# Altium project Main PCB.PrjPCB
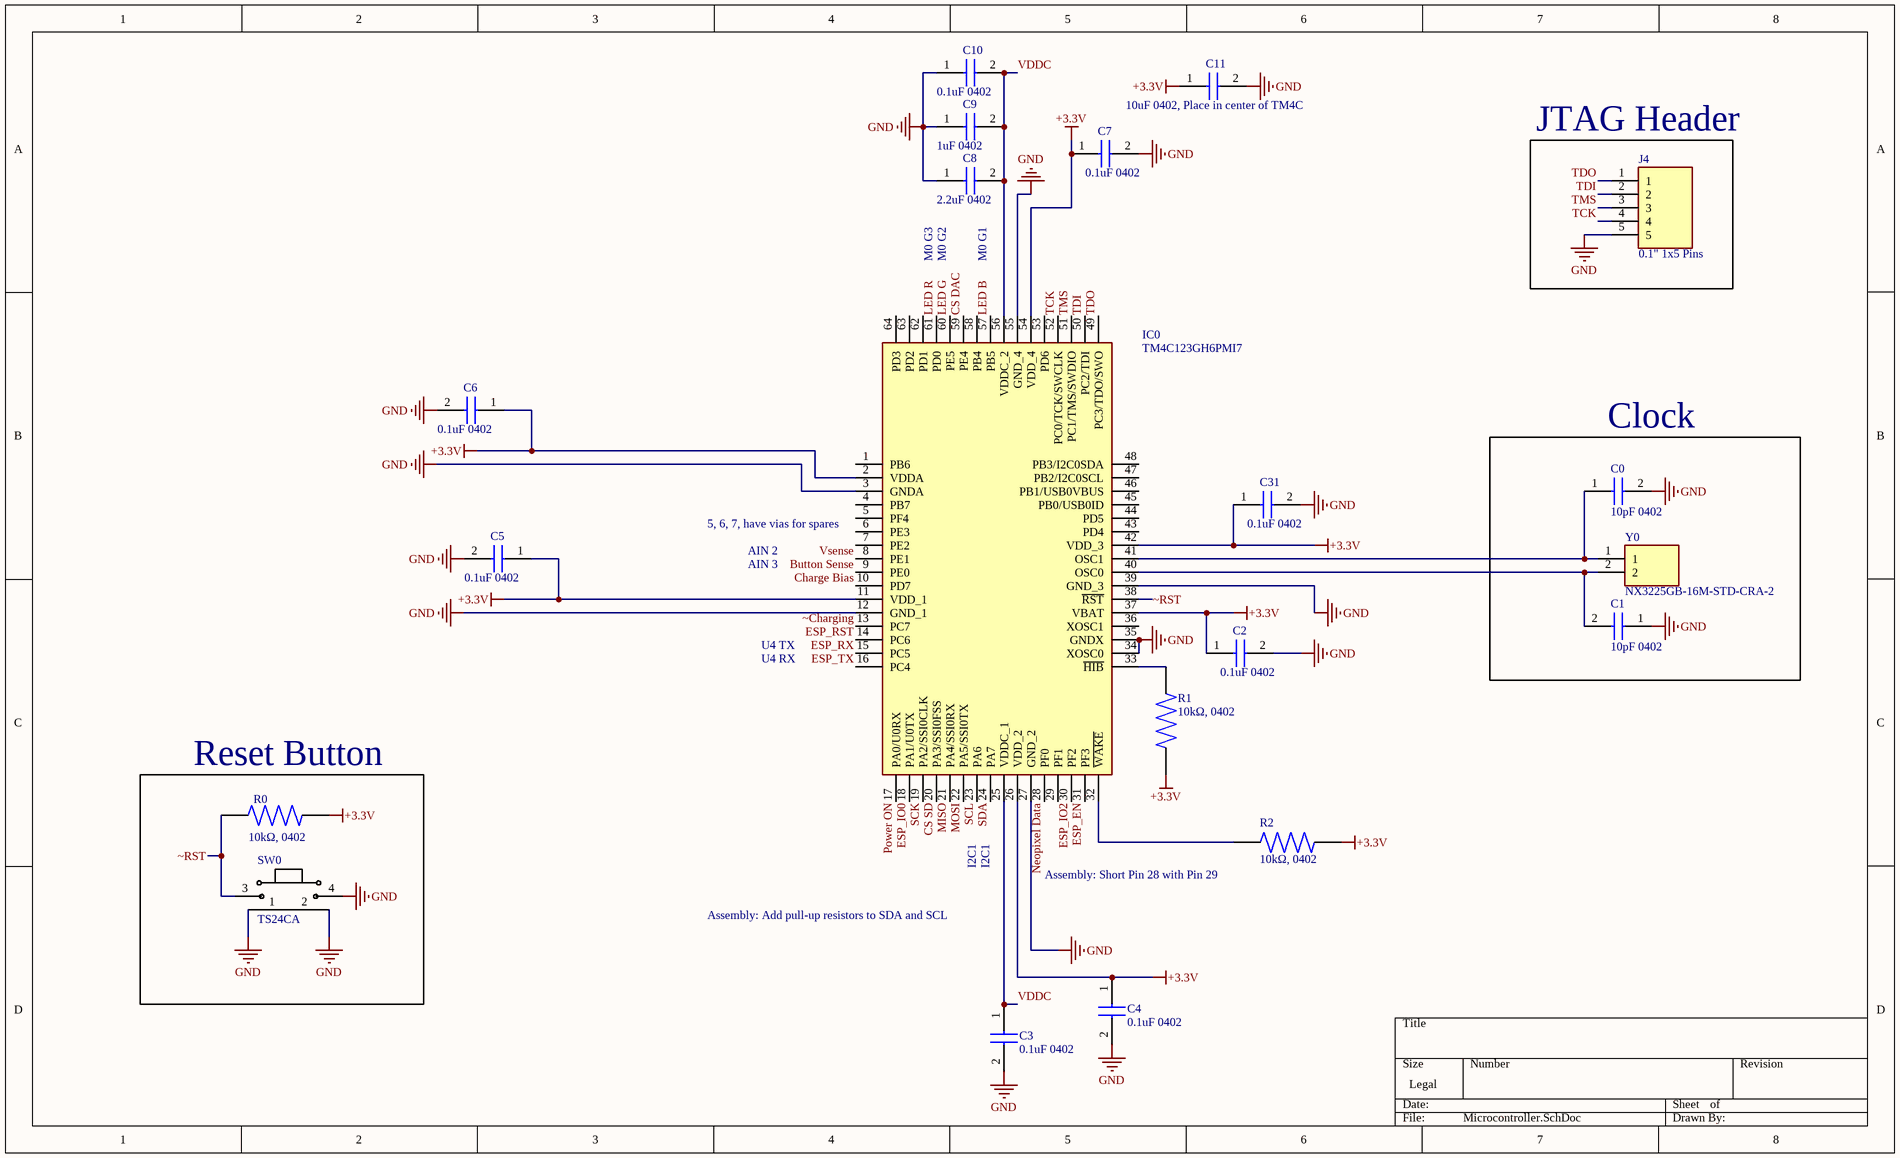
[diagram p0: Microcontroller.SchDoc]
3 sheets, 79 parts. Net scope: global (net labels, ports and power ports of the same name join across sheets).
Board files: jlcpcb.PcbDoc, main pcb.PcbDoc
Sheets:
  Microcontroller.SchDoc
  Peripherals.SchDoc
  Power.SchDoc

## Sheet Microcontroller.SchDoc
size Legal

### Parts
C0  10pF 0402  [CAPC1005X56N]
C1  10pF 0402  [CAPC1005X56N]
C2  0.1uF 0402  [CAPC1005X56N]
C3  0.1uF 0402  [CAPC1005X56N]
C4  0.1uF 0402  [CAPC1005X56N]
C5  0.1uF 0402  [CAPC1005X56N]
C6  0.1uF 0402  [CAPC1005X56N]
C7  0.1uF 0402  [CAPC1005X56N]
C8  2.2uF 0402  [CAPC1005X56N]
C9  1uF 0402  [CAPC1005X56N]
C10  0.1uF 0402  [CAPC1005X56N]
C11  10uF 0402, Place in center of TM4C  [CAPC1005X56N]
C31  0.1uF 0402  [CAPC1005X56N]
IC0  TM4C123GH6PMI7  [QFP50P1200X1200X160-64N]
J4  0.1" 1x5 Pins  [HDRV5W64P0X254_1X5_1270X254X610P]
R0  10kΩ, 0402  [0402]
R1  10kΩ, 0402  [0402]
R2  10kΩ, 0402  [0402]
SW0  TS24CA  [TS24CA]
Y0  NX3225GB-16M-STD-CRA-2  [NX3225GD-STD-CRA-3]

### Blocks framed on the sheet
JTAG Header: J4
Clock: C0 C1 Y0
Reset Button: R0 SW0

### Nets
+3.3V: C2.1 C4.1 C5.1 C6.1 C7.1 C11.1 C31.1 IC0.2(VDDA) IC0.11(VDD_1) IC0.26(VDD_2) IC0.37(VBAT) IC0.42(VDD_3) IC0.54(VDD_4) R0.2 R1.2 R2.2
GND: C0.2 C1.1 C2.2 C3.2 C4.2 C5.2 C6.2 C7.2 C8.1 C9.1 C10.1 C11.2 C31.2 IC0.3(GNDA) IC0.12(GND_1) IC0.27(GND_2) IC0.34(XOSC0) IC0.35(GNDX) IC0.39(GND_3) IC0.55(GND_4) J4.5 SW0.1 SW0.2 SW0.4
Button Sense: IC0.9(PE0)  [project net Button N/O B]
Charge Bias: IC0.10(PD7)
CS DAC: IC0.59(PE4)
CS SD: IC0.20(PA3/SSI0FSS)
ESP_EN: IC0.31(PF3)
ESP_IO0: IC0.18(PA1/U0TX)
ESP_IO2: IC0.30(PF2)
ESP_RST: IC0.14(PC6)
ESP_RX: IC0.15(PC5)
ESP_TX: IC0.16(PC4)
LED B: IC0.57(PB5)
LED G: IC0.60(PE5)
LED R: IC0.61(PD0)
MISO: IC0.21(PA4/SSI0RX)
MOSI: IC0.22(PA5/SSI0TX)
Neopixel Data: IC0.28(PF0)
Power ON: IC0.17(PA0/U0RX)
SCK: IC0.19(PA2/SSI0CLK)
SCL: IC0.23(PA6)
SDA: IC0.24(PA7)
TCK: IC0.52(PC0/TCK/SWCLK) J4.4
TDI: IC0.50(PC2/TDI) J4.2
TDO: IC0.49(PC3/TDO/SWO) J4.1
TMS: IC0.51(PC1/TMS/SWDIO) J4.3
VDDC: C3.1 C8.2 C9.2 C10.2 IC0.25(VDDC_1) IC0.56(VDDC_2)
Vsense: IC0.8(PE1)
~Charging: IC0.13(PC7)
~RST: IC0.38(~{RST}) R0.1 SW0.3
NetC0_1: C0.1 IC0.41(OSC1) Y0.1
NetC1_2: C1.2 IC0.40(OSC0) Y0.2
NetIC0_32: IC0.32(~{WAKE}) R2.1
NetIC0_33: IC0.33(~{HIB}) R1.1

Not connected (* = marked no-connect by the designer): IC0 1(PB6) 4(PB7) 5(PF4) 6(PE3) 7(PE2) 29(PF1) 36(XOSC1) 43(PD4) 44(PD5) 45(PB0/USB0ID) 46(PB1/USB0VBUS) 47(PB2/I2C0SCL) 48(PB3/I2C0SDA) 53(PD6) 58(PB4) 62(PD1) 63(PD2) 64(PD3)

### Notes on the sheet
- M0 G3
- M0 G2
- (near C8) M0 G1
- (near IC0) 5, 6, 7, have vias for spares
- AIN 2
- AIN 3
- U4 TX
- U4 RX
- I2C1
- (near R2) Assembly: Short Pin 28 with Pin 29
- Assembly: Add pull-up resistors to SDA and SCL

### Library data of the parts
C0-C11 C31 = 04025A100BAT2A: Capacitor; Manufacturer_Name: AVX; Datasheet Link: http://www.mouser.com/catalog/supplier/library/pdf/AVXSurfaceMountCeramic.pdf; Height: 0.56mm; Manufacturer_Part_Number: 04025A100BAT2A; Arrow Part Number: 04025A100BAT2A; Arrow Price/Stock: https://www.arrow.com/en/products/04025a100bat2a/avx; Mouser Part Number: 581-04025A100B; Mouser Price/Stock: https://www.mouser.com/Search/Refine.aspx?Keyword=581-04025A100B
IC0 = TM4C123GH6PMI7: Integrated Circuit; Manufacturer_Name: Texas Instruments; Datasheet Link: http://www.ti.com/lit/gpn/tm4c123gh6pm; Height: 1.6mm; Manufacturer_Part_Number: TM4C123GH6PMI7; Arrow Part Number: TM4C123GH6PMI7; Arrow Price/Stock: https://www.arrow.com/en/products/tm4c123gh6pmi7/texas-instruments; Mouser Part Number: 595-TM4C123GH6PMI7; Mouser Price/Stock: https://www.mouser.co.uk/ProductDetail/Texas-Instruments/TM4C123GH6PMI7?qs=m%2F7bTylgptcEEuXHNU46tA%3D%3D
J4 = M20-9990546: Connector; Manufacturer_Name: Harwin; Datasheet Link: http://docs-emea.rs-online.com/webdocs/0da6/0900766b80da602d.pdf; Height: 6.1mm; Manufacturer_Part_Number: M20-9990546; Mouser Part Number: 855-M20-9990546; Mouser Price/Stock: https://www.mouser.co.uk/ProductDetail/Harwin/M20-9990546?qs=ulE8k0yEMYY8EKyDN9ic6A%3D%3D
R0-R2 = Resistor, 0402
Y0 = NX3225GB-16M-STD-CRA-2: Crystal or Oscillator; Manufacturer_Name: NDK; Datasheet Link: http://www.ndk.com/images/products/catalog/c_NX3225GB-STD-CRA-2_e.pdf; Manufacturer_Part_Number: NX3225GB-16M-STD-CRA-2; Mouser Part Number: 344-NX3225GB16MSTRA2; Mouser Price/Stock: https://www.mouser.co.uk/ProductDetail/NDK/NX3225GB-16M-STD-CRA-2?qs=w%2Fv1CP2dgqqz6Fo69dRGLg%3D%3D

## Sheet Peripherals.SchDoc
size Legal
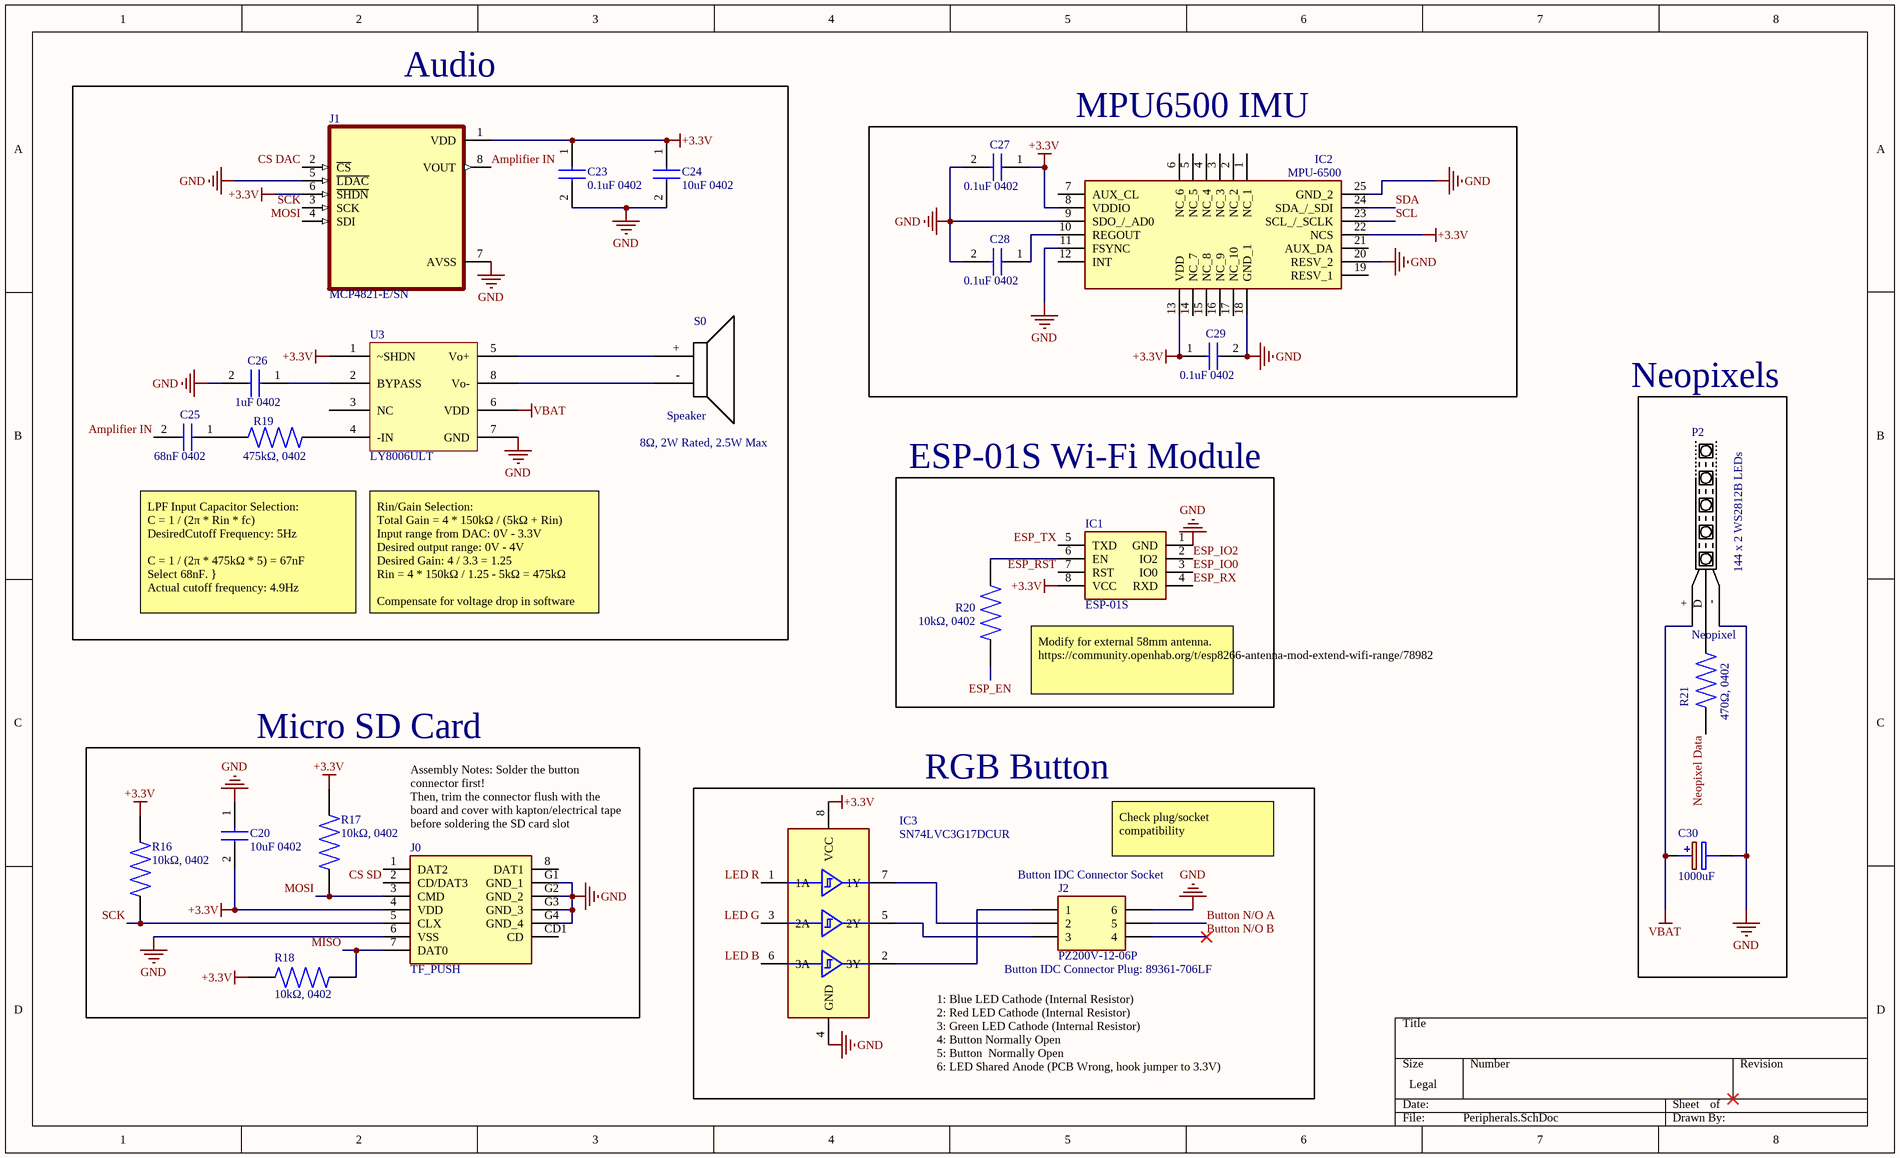
[diagram p1: Peripherals.SchDoc]

### Parts
C20  10uF 0402  [CAPC1005X56N]
C23  0.1uF 0402  [CAPC1005X56N]
C24  10uF 0402  [CAPC1005X56N]
C25  68nF 0402  [CAPC1005X56N]
C26  1uF 0402  [CAPC1005X56N]
C27  0.1uF 0402  [CAPC1005X56N]
C28  0.1uF 0402  [CAPC1005X56N]
C29  0.1uF 0402  [CAPC1005X56N]
C30  1000uF  [8x10.2mm Radial Capacitor]
IC1  ESP-01S  [ESP-01]
IC2  MPU-6500  [QFN-24]
IC3  SN74LVC3G17DCUR  [SOP50P310X90-8N]
J0  TF_PUSH  [TFPUSH]
J1  MCP4821-E/SN  [SOIC127P600X175-8N]
J2  PZ200V-12-06P  [2mm 2x3 Header TH]
P2  Neopixel  [Neopixel Pads]
R16  10kΩ, 0402  [0402]
R17  10kΩ, 0402  [0402]
R18  10kΩ, 0402  [0402]
R19  475kΩ, 0402  [0402]
R20  10kΩ, 0402  [0402]
R21  470Ω, 0402  [0402]
S0  Speaker  [SPEAKER PADS]
U3  LY8006ULT  [MSOP-8]

### Blocks framed on the sheet
Audio: C23-C26 J1 R19 S0 U3
MPU6500 IMU: C27-C29 IC2
Neopixels: C30 P2 R21
ESP-01S Wi-Fi Module: IC1 R20
Micro SD Card: C20 J0 R16-R18
RGB Button: IC3 J2

### Nets
+3.3V: C20.2 C23.1 C24.1 C27.1 C29.1 IC1.8(VCC) IC2.8(VDDIO) IC2.13(VDD) IC2.22(NCS) IC3.8(VCC) J0.4(VDD) J1.1(VDD) J1.6(~{SHDN}) R16.2 R17.2 R18.2 U3.1(~SHDN)
GND: C20.1 C23.2 C24.2 C26.2 C27.2 C28.2 C29.2 C30.2(-) IC1.1(GND) IC2.9(SDO_/_AD0) IC2.11(FSYNC) IC2.18(GND_1) IC2.20(RESV_2) IC2.25(GND_2) IC3.4(GND) J0.6(VSS) J0.G1(GND_1) J0.G2(GND_2) J0.G3(GND_3) J0.G4(GND_4) J1.5(~{LDAC}) J1.7(AVSS) J2.6 P2.- U3.7(GND)
VBAT: C30.1(+) P2.+ U3.6(VDD)
Amplifier IN: C25.2 J1.8(VOUT)
Button N/O A: J2.5
Button N/O B: J2.4
CS DAC: J1.2(~{CS})
CS SD: J0.2(CD/DAT3)
ESP_EN: R20.1
ESP_IO0: IC1.3(IO0)
ESP_IO2: IC1.2(IO2)
ESP_RST: IC1.7(RST)
ESP_RX: IC1.4(RXD)
ESP_TX: IC1.5(TXD)
LED B: IC3.6(3A)
LED G: IC3.3(2A)
LED R: IC3.1(1A)
MISO: J0.7(DAT0) R18.1
MOSI: J0.3(CMD) J1.4(SDI) R17.1
Neopixel Data: R21.2
SCK: J0.5(CLX) J1.3(SCK) R16.1
SCL: IC2.23(SCL_/_SCLK)
SDA: IC2.24(SDA_/_SDI)
NetC25_1: C25.1 R19.1
NetC26_1: C26.1 U3.2(BYPASS)
NetC28_1: C28.1 IC2.10(REGOUT)
NetIC1_6: IC1.6(EN) R20.2
NetIC3_2: IC3.2(3Y) J2.1
NetIC3_5: IC3.5(2Y) J2.3
NetIC3_7: IC3.7(1Y) J2.2
NetP2_D: P2.D R21.1
NetR19_2: R19.2 U3.4(-IN)
NetS0_+: S0.+ U3.5(Vo+)
NetS0_-: S0.- U3.8(Vo-)

Not connected (* = marked no-connect by the designer): IC2 1(NC_1) 2(NC_2) 3(NC_3) 4(NC_4) 5(NC_5) 6(NC_6) 7(AUX_CL) 12(INT) 14(NC_7) 15(NC_8) 16(NC_9) 17(NC_10) 19(RESV_1) 21(AUX_DA); J0 1(DAT2) 8(DAT1) CD1(CD); U3 3(NC)

### Notes on the sheet
- 8Ω, 2W Rated, 2.5W Max
- (near P2) 144 x 2 WS2812B LEDs
- LPF Input Capacitor Selection:
  C = 1 / (2π * Rin * fc)
  DesiredCutoff Frequency: 5Hz
  C = 1 / (2π * 475kΩ * 5) = 67nF
  Select 68nF. }
  Actual cutoff frequency: 4.9Hz
- Rin/Gain Selection:
  Total Gain = 4 * 150kΩ / (5kΩ + Rin)
  Input range from DAC: 0V - 3.3V
  Desired output range: 0V - 4V
  Desired Gain: 4 / 3.3 = 1.25
  Rin = 4 * 150kΩ / 1.25 - 5kΩ = 475kΩ
  Compensate for voltage drop in software
- Modify for external 58mm antenna.
  https://community.openhab.org/t/esp8266-antenna-mod-extend-wifi-range/78982
- (near J0) Assembly Notes: Solder the button connector first!
  Then, trim the connector flush with the board and cover with kapton/electrical tape before soldering the SD card slot
- (near J2) Button IDC Connector Socket
- Check plug/socket compatibility
- (near J2) Button IDC Connector Plug: 89361-706LF
- 1: Blue LED Cathode (Internal Resistor)
  2: Red LED Cathode (Internal Resistor)
  3: Green LED Cathode (Internal Resistor)
  4: Button Normally Open
  5: Button  Normally Open
  6: LED Shared Anode (PCB Wrong, hook jumper to 3.3V)

### Library data of the parts
C20 C23-C29 = 04025A100BAT2A: Capacitor; Manufacturer_Name: AVX; Datasheet Link: http://www.mouser.com/catalog/supplier/library/pdf/AVXSurfaceMountCeramic.pdf; Height: 0.56mm; Manufacturer_Part_Number: 04025A100BAT2A; Arrow Part Number: 04025A100BAT2A; Arrow Price/Stock: https://www.arrow.com/en/products/04025a100bat2a/avx; Mouser Part Number: 581-04025A100B; Mouser Price/Stock: https://www.mouser.com/Search/Refine.aspx?Keyword=581-04025A100B
C30 = 8x10.2mm Radial Capacitor: Capacitor Polarised; Manufacturer_Name: Cinch Connectivity Solutions; Manufacturer_Part_Number: 107CKS035M; Datasheet Link: http://www.farnell.com/datasheets/1912641.pdf; Height: 12.5mm
IC1 = ESP-01S: Integrated Circuit; Manufacturer_Name: Ai-Thinker; Datasheet Link: http://wiki.ai-thinker.com/_media/esp8266/esp8266_series_modules_user_manual_v1.1.pdf; Height: 2mm; Manufacturer_Part_Number: ESP-01
IC2 = MPU-6500: Integrated Circuit; Manufacturer_Name: TDK; Datasheet Link: https://www.invensense.com/wp-content/uploads/2015/02/MPU-6500-Datasheet2.pdf; Height: 0.95mm; Manufacturer_Part_Number: MPU-6500; Arrow Part Number: MPU-6500; Arrow Price/Stock: https://www.arrow.com/en/products/mpu-6500/invensense; Mouser Part Number: 410-MPU-6500
IC3 = SN74LVC3G17DCUR: Integrated Circuit; Manufacturer_Name: Texas Instruments; Datasheet Link: http://www.ti.com/lit/ds/symlink/sn74lvc3g17.pdf; Height: 0.9mm; Manufacturer_Part_Number: SN74LVC3G17DCUR; Arrow Part Number: SN74LVC3G17DCUR; Arrow Price/Stock: https://www.arrow.com/en/products/sn74lvc3g17dcur/texas-instruments; Mouser Part Number: 595-SN74LVC3G17DCUR; Mouser Price/Stock: https://www.mouser.co.uk/ProductDetail/Texas-Instruments/SN74LVC3G17DCUR?qs=0smPjiIwnfJ%2FZmnYCRa%2FdA%3D%3D
J0 = TF_PUSH: Connector; Manufacturer_Name: Shou Han; Manufacturer_Part_Number: TF PUSH; Datasheet Link: https://datasheet.lcsc.com/szlcsc/1912111437_SHOU-HAN-TF-PUSH_C393941.pdf; Height: 2mm
J1 = MCP4821-E/SN: MF: {'manufacturer': u'Microchip'}; MP: MCP4821-E/SN; Price: None; Availability: Unavailable; Value: *; Package: None
J2 = PZ200V-12-06P: Connector; Manufacturer_Name: Amphenol; Manufacturer_Part_Number: 54202-G08-03; Datasheet Link: https://cdn.amphenol-icc.com/media/wysiwyg/files/drawing/54202.pdf; Height: 9.85mm; Arrow Part Number: 54202-G08-03; Arrow Price/Stock: https://www.arrow.com/en/products/54202-g08-03/amphenol-fci; Mouser Part Number: 649-54202-G08-03; Mouser Price/Stock: https://www.mouser.co.uk/ProductDetail/Amphenol-FCI/54202-G08-03?qs=GN3JspNYOhaVPFh0SDYuCQ%3D%3D
R16-R21 = Resistor, 0402

## Sheet Power.SchDoc
size Legal
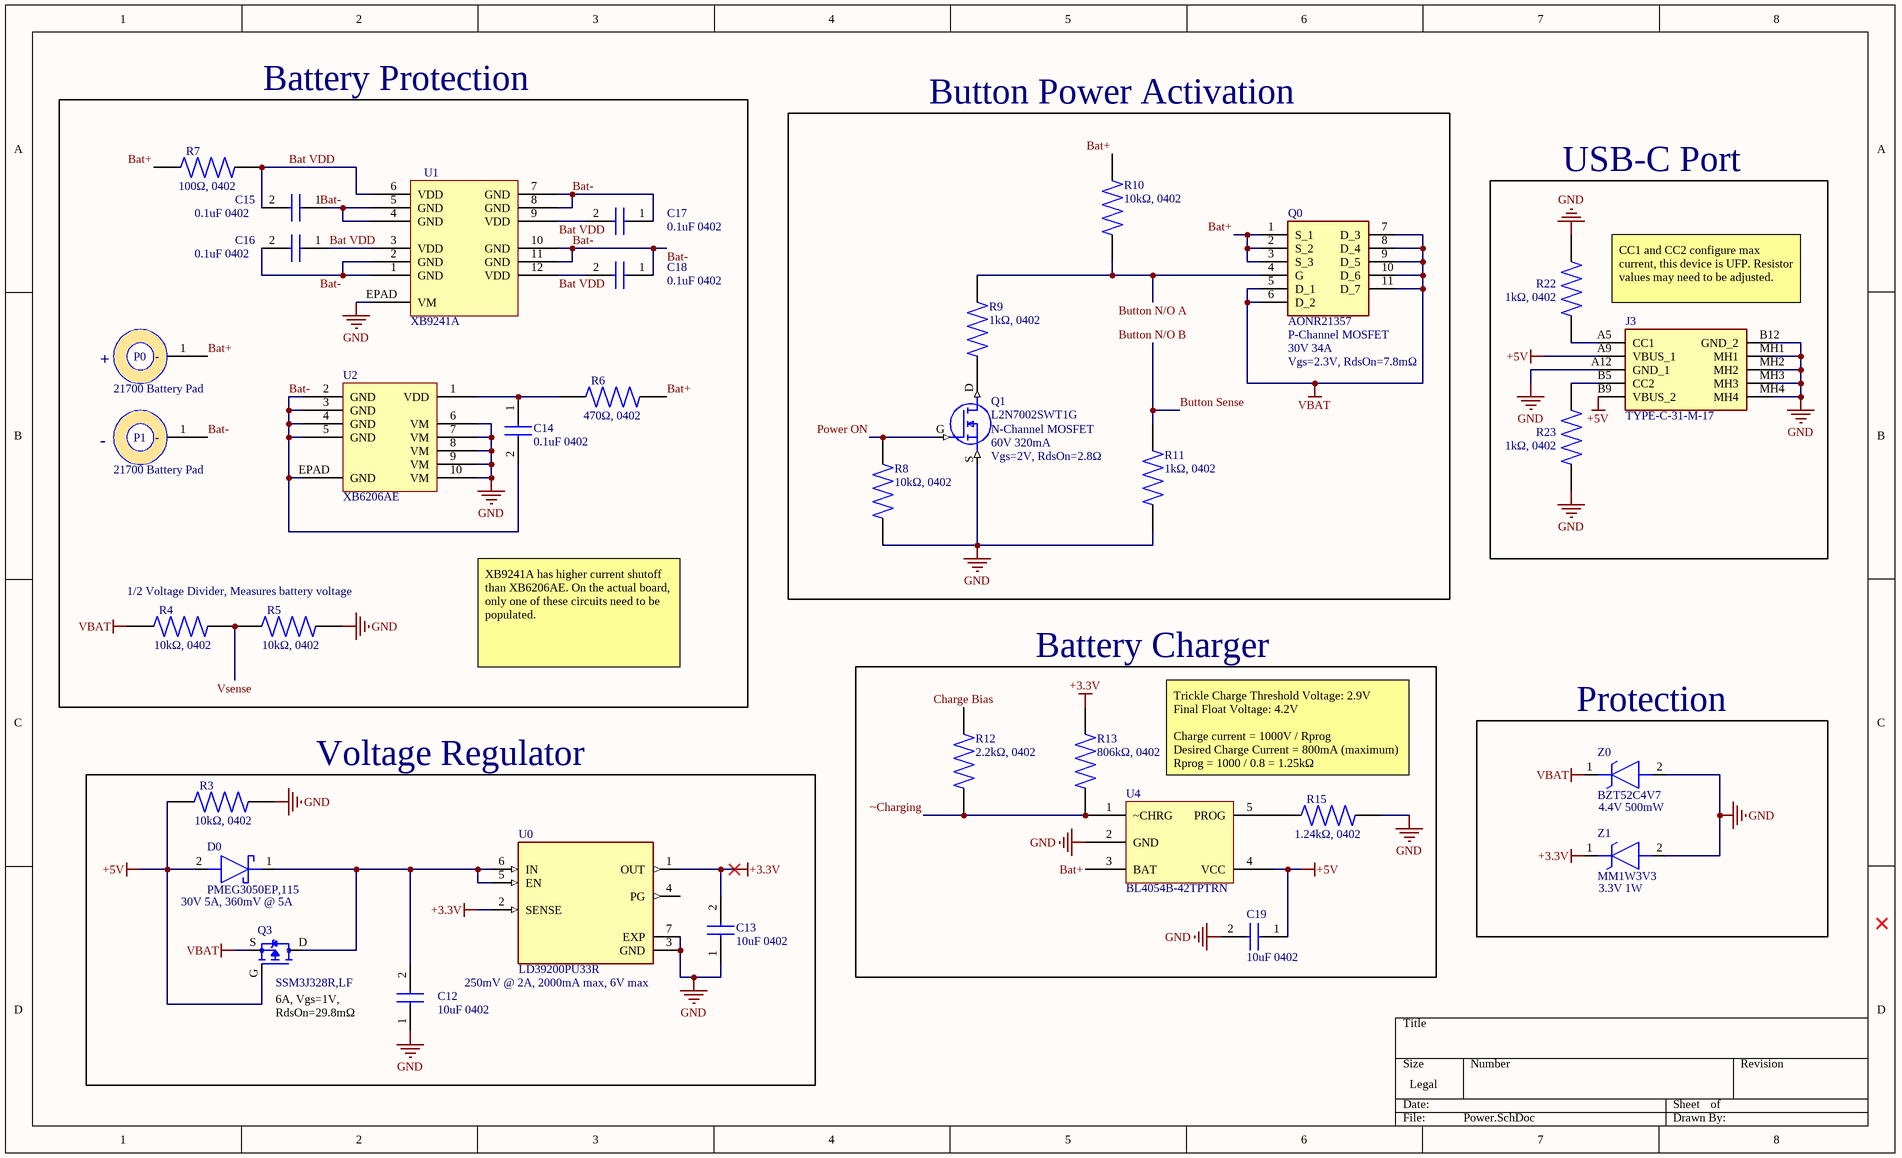
[diagram p2: Power.SchDoc]

### Parts
C12  10uF 0402  [CAPC1005X56N]
C13  10uF 0402  [CAPC1005X56N]
C14  0.1uF 0402  [CAPC1005X56N]
C15  0.1uF 0402  [CAPC1005X56N]
C16  0.1uF 0402  [CAPC1005X56N]
C17  0.1uF 0402  [CAPC1005X56N]
C18  0.1uF 0402  [CAPC1005X56N]
C19  10uF 0402  [CAPC1005X56N]
D0  PMEG3050EP,115  [SOD128]
J3  TYPE-C-31-M-17  [TYPEC31M17]
P0  21700 Battery Pad  [21700 Battery Pad]
P1  21700 Battery Pad  [21700 Battery Pad]
Q0  AONR21357  [AONR21357]
Q1  L2N7002SWT1G  [SC-70]
Q3  SSM3J328R,LF  [SOT-23F]
R3  10kΩ, 0402  [0402]
R4  10kΩ, 0402  [0402]
R5  10kΩ, 0402  [0402]
R6  470Ω, 0402  [0402]
R7  100Ω, 0402  [0402]
R8  10kΩ, 0402  [0402]
R9  1kΩ, 0402  [0402]
R10  10kΩ, 0402  [0402]
R11  1kΩ, 0402  [0402]
R12  2.2kΩ, 0402  [0402]
R13  806kΩ, 0402  [0402]
R15  1.24kΩ, 0402  [0402]
R22  1kΩ, 0402  [0402]
R23  1kΩ, 0402  [0402]
U0  LD39200PU33R  [SON95P300X300X100-7N]
U1  XB9241A  [DFN4x4x0.55-12FC]
U2  XB6206AE  [DFN3X3-10]
U4  BL4054B-42TPTRN  [TSOT23-5]
Z0  BZT52C4V7  [SOD-123]
Z1  MM1W3V3  [SOD-123]

### Blocks framed on the sheet
Battery Protection: C14-C18 P0 P1 R4-R7 U1 U2
Button Power Activation: Q0 Q1 R8-R11
USB-C Port: J3 R22 R23
Battery Charger: C19 R12 R13 R15 U4
Protection: Z0 Z1
Voltage Regulator: C12 C13 D0 Q3 R3 U0

### Nets
+3.3V: C13.2 R13.2 U0.1(OUT) U0.2(SENSE) Z1.1(K)
+5V: C19.1 D0.2(A) J3.A9(VBUS_1) J3.B9(VBUS_2) Q3.G R3.1 U4.4(VCC)
GND: C12.1 C13.1 C19.2 J3.A12(GND_1) J3.B12(GND_2) J3.MH1 J3.MH2 J3.MH3 J3.MH4 Q1.S R3.2 R5.2 R8.1 R11.1 R15.2 R22.2 R23.1 U0.3(GND) U0.7(EXP) U1.EPAD(VM) U2.6(VM) U2.7(VM) U2.8(VM) U2.9(VM) U2.10(VM) U4.2(GND) Z0.2(A) Z1.2(A)
VBAT: Q0.5(D_1) Q0.6(D_2) Q0.7(D_3) Q0.8(D_4) Q0.9(D_5) Q0.10(D_6) Q0.11(D_7) Q3.S R4.1 Z0.1(K)
Bat VDD: C15.2 C16.1 C17.2 C18.2 R7.2 U1.3(VDD) U1.6(VDD) U1.9(VDD) U1.12(VDD)
Bat+: P0.1(-) Q0.1(S_1) Q0.2(S_2) Q0.3(S_3) R6.2 R7.1 R10.2 U4.3(BAT)
Bat-: C14.2 C15.1 C16.2 C17.1 C18.1 P1.1(-) U1.1(GND) U1.2(GND) U1.4(GND) U1.5(GND) U1.7(GND) U1.8(GND) U1.10(GND) U1.11(GND) U2.2(GND) U2.3(GND) U2.4(GND) U2.5(GND) U2.EPAD(GND)
Button N/O A: Q0.4(G) R9.2 R10.1
Button N/O B: R11.2  [also labelled Button Sense]
Charge Bias: R12.2
Power ON: Q1.G R8.2
Vsense: R4.2 R5.1
~Charging: R12.1 R13.1 U4.1(~CHRG)
NetC12_2: C12.2 D0.1(K) Q3.D U0.5(EN) U0.6(IN)
NetC14_1: C14.1 R6.1 U2.1(VDD)
NetJ3_A5: J3.A5(CC1) R22.1
NetJ3_B5: J3.B5(CC2) R23.2
NetQ1_D: Q1.D R9.1
NetR15_1: R15.1 U4.5(PROG)

Not connected (* = marked no-connect by the designer): U0 4(PG)

### Notes on the sheet
- CC1 and CC2 configure max current, this device is UFP. Resistor values may need to be adjusted.
- +
- (near Q0) P-Channel MOSFET
- (near Q0) 30V 34A
- Vgs=2.3V, RdsOn=7.8mΩ
- (near Q1) N-Channel MOSFET
- -
- (near Q1) 60V 320mA
- (near Q1) Vgs=2V, RdsOn=2.8Ω
- 1/2 Voltage Divider, Measures battery voltage
- XB9241A has higher current shutoff than XB6206AE. On the actual board, only one of these circuits need to be populated.
- Trickle Charge Threshold Voltage: 2.9V
  Final Float Voltage: 4.2V
  Charge current = 1000V / Rprog
  Desired Charge Current = 800mA (maximum)
  Rprog = 1000 / 0.8 = 1.25kΩ
- 4.4V 500mW
- 30V 5A, 360mV @ 5A
- (near Z1) 3.3V 1W
- 6A, Vgs=1V,
  RdsOn=29.8mΩ
- (near U0) 250mV @ 2A, 2000mA max, 6V max

### Library data of the parts
C12-C19 = 04025A100BAT2A: Capacitor; Manufacturer_Name: AVX; Datasheet Link: http://www.mouser.com/catalog/supplier/library/pdf/AVXSurfaceMountCeramic.pdf; Height: 0.56mm; Manufacturer_Part_Number: 04025A100BAT2A; Arrow Part Number: 04025A100BAT2A; Arrow Price/Stock: https://www.arrow.com/en/products/04025a100bat2a/avx; Mouser Part Number: 581-04025A100B; Mouser Price/Stock: https://www.mouser.com/Search/Refine.aspx?Keyword=581-04025A100B
D0 = PMEG3050EP,115: Schottky Diode; Manufacturer_Name: Nexperia; Datasheet Link: https://docs-emea.rs-online.com/webdocs/14cd/0900766b814cd012.pdf; Height: 1mm; Manufacturer_Part_Number: PMEG3050EP,115; Arrow Part Number: PMEG3050EP,115; Arrow Price/Stock: https://www.arrow.com/en/products/pmeg3050ep115/nexperia; Mouser Part Number: 771-PMEG3050EP115; Mouser Price/Stock: https://www.mouser.co.uk/ProductDetail/Nexperia/PMEG3050EP115?qs=GcY6OjH1zdmnjQ%2FhUT5aOA%3D%3D
J3 = TYPE-C-31-M-17: Connector; Manufacturer_Name: Korean Hroparts Elec; Datasheet Link: https://datasheet.lcsc.com/szlcsc/1903211732_Korean-Hroparts-Elec-TYPE-C-31-M-17_C283540.pdf; Height: 3.26mm; Manufacturer_Part_Number: TYPE-C-31-M-17
Q0 = AONR21357: MOSFET (P-Channel); Manufacturer_Name: Alpha & Omega Semiconductors; Datasheet Link: https://datasheet.lcsc.com/szlcsc/1910101232_Alpha-Omega-Semicon-AOS-AONR21357_C431196.pdf; Height: 0.9mm; Manufacturer_Part_Number: AONR21357
Q1 = L2N7002SWT1G: MOSFET (N-Channel); pin to pad: D>3 G>1 S>2; Manufacturer_Name: ON Semiconductor; Manufacturer_Part_Number: 2N7000; Datasheet Link: http://www.onsemi.com/pub/Collateral/NDS7002A-D.PDF; Mouser Part Number: 512-2N7000; Mouser Price/Stock: https://www.mouser.co.uk/ProductDetail/ON-Semiconductor/2N7000?qs=FOlmdCx%252BAA2o%2FKZOTk%2F3hg%3D%3D; Arrow Part Number: 2N7000; Arrow Price/Stock: https://www.arrow.com/en/products/2n7000/on-semiconductor
Q3 = SSM3J328R,LF: P-Channel 20V 9.4A (Ta) 2.4W (Ta) Surface Mount 6-MicroFET (2x2); pin to pad: D>3 G>1 S>2; MP: FDMA910PZ; MF: {'manufacturer': u'ON Semiconductor'}; Package: None; Availability: Unavailable; Value: *; Price: None
R3-R13 R15 R22 R23 = Resistor, 0402
U0 = LD39200PU33R: Linear Voltage Regulator IC 1 Output 2A 6-DFN (3x3); MF: {'manufacturer': u'STMicroelectronics'}; Availability: Unavailable; MP: LD39200PU33R; Package: None; Price: None; Value: *
Z0 = BZT52C4V7: Zener Diode; Manufacturer_Name: Nexperia; Manufacturer_Part_Number: BZT52-B5V1J; Datasheet Link: https://assets.nexperia.com/documents/data-sheet/BZT52-B_SER.pdf; Height: 1.3mm; Mouser Part Number: 771-BZT52-B5V1J; Mouser Price/Stock: https://www.mouser.co.uk/ProductDetail/Nexperia/BZT52-B5V1J/?qs=W0yvOO0ixfGU2vzMfcQu3g%3D%3D; Arrow Part Number: BZT52-B5V1J; Arrow Price/Stock: https://www.arrow.com/en/products/bzt52-b5v1j/nexperia
Z1 = MM1W3V3: Zener Diode; Manufacturer_Name: Nexperia; Manufacturer_Part_Number: BZT52-B5V1J; Datasheet Link: https://assets.nexperia.com/documents/data-sheet/BZT52-B_SER.pdf; Height: 1.3mm; Mouser Part Number: 771-BZT52-B5V1J; Mouser Price/Stock: https://www.mouser.co.uk/ProductDetail/Nexperia/BZT52-B5V1J/?qs=W0yvOO0ixfGU2vzMfcQu3g%3D%3D; Arrow Part Number: BZT52-B5V1J; Arrow Price/Stock: https://www.arrow.com/en/products/bzt52-b5v1j/nexperia

## Nets that join several sheets
+3.3V: Microcontroller (16 pins), Peripherals (17 pins), Power (5 pins)
GND: Microcontroller (24 pins), Peripherals (25 pins), Power (28 pins)
VBAT: Peripherals (C30.1 P2.+ U3.6), Power (10 pins)
Button N/O A: Peripherals (J2.5), Power (Q0.4 R9.2 R10.1)
Button N/O B: Microcontroller (IC0.9), Peripherals (J2.4), Power (R11.2)
Charge Bias: Microcontroller (IC0.10), Power (R12.2)
CS DAC: Microcontroller (IC0.59), Peripherals (J1.2)
CS SD: Microcontroller (IC0.20), Peripherals (J0.2)
ESP_EN: Microcontroller (IC0.31), Peripherals (R20.1)
ESP_IO0: Microcontroller (IC0.18), Peripherals (IC1.3)
ESP_IO2: Microcontroller (IC0.30), Peripherals (IC1.2)
ESP_RST: Microcontroller (IC0.14), Peripherals (IC1.7)
ESP_RX: Microcontroller (IC0.15), Peripherals (IC1.4)
ESP_TX: Microcontroller (IC0.16), Peripherals (IC1.5)
LED B: Microcontroller (IC0.57), Peripherals (IC3.6)
LED G: Microcontroller (IC0.60), Peripherals (IC3.3)
LED R: Microcontroller (IC0.61), Peripherals (IC3.1)
MISO: Microcontroller (IC0.21), Peripherals (J0.7 R18.1)
MOSI: Microcontroller (IC0.22), Peripherals (J0.3 J1.4 R17.1)
Neopixel Data: Microcontroller (IC0.28), Peripherals (R21.2)
Power ON: Microcontroller (IC0.17), Power (Q1.G R8.2)
SCK: Microcontroller (IC0.19), Peripherals (J0.5 J1.3 R16.1)
SCL: Microcontroller (IC0.23), Peripherals (IC2.23)
SDA: Microcontroller (IC0.24), Peripherals (IC2.24)
Vsense: Microcontroller (IC0.8), Power (R4.2 R5.1)
~Charging: Microcontroller (IC0.13), Power (R12.1 R13.1 U4.1)